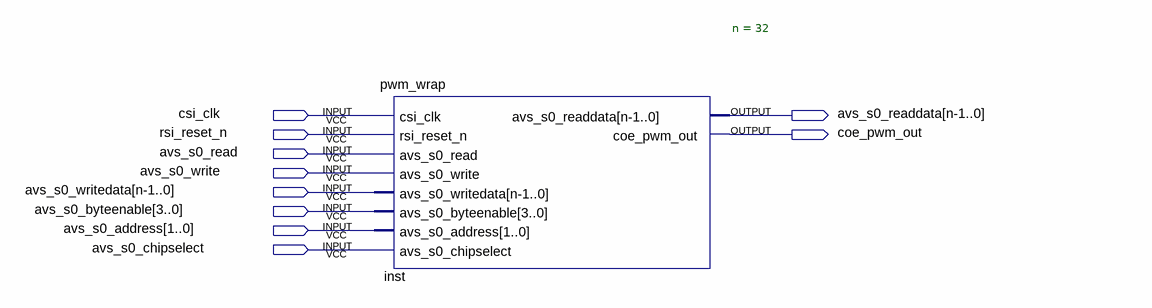
[diagram p0: schematic sheet]
// Quartus schematic avalon_wrapper_block.bdf as structural Verilog: 1 symbols, 10 pins
module avalon_wrapper_block (
  input  csi_clk,
  input  rsi_reset_n,
  input  avs_s0_read,
  input  avs_s0_write,
  input  \avs_s0_writedata[n-1..0] ,
  input  [3:0] avs_s0_byteenable,
  input  [1:0] avs_s0_address,
  input  avs_s0_chipselect,
  output \avs_s0_readdata[n-1..0] ,
  output coe_pwm_out
);

  pwm_wrap #(.n(32)) inst (
    .csi_clk(csi_clk), .rsi_reset_n(rsi_reset_n), .avs_s0_read(avs_s0_read), .avs_s0_write(avs_s0_write),
    .avs_s0_writedata({32{\avs_s0_writedata[n-1..0] }}), .avs_s0_byteenable(avs_s0_byteenable),
    .avs_s0_address(avs_s0_address), .avs_s0_chipselect(avs_s0_chipselect),
    .avs_s0_readdata(\avs_s0_readdata[n-1..0] ), .coe_pwm_out(coe_pwm_out));
endmodule
